# EAGLE design ac_mk2 (EAGLE 6.1)
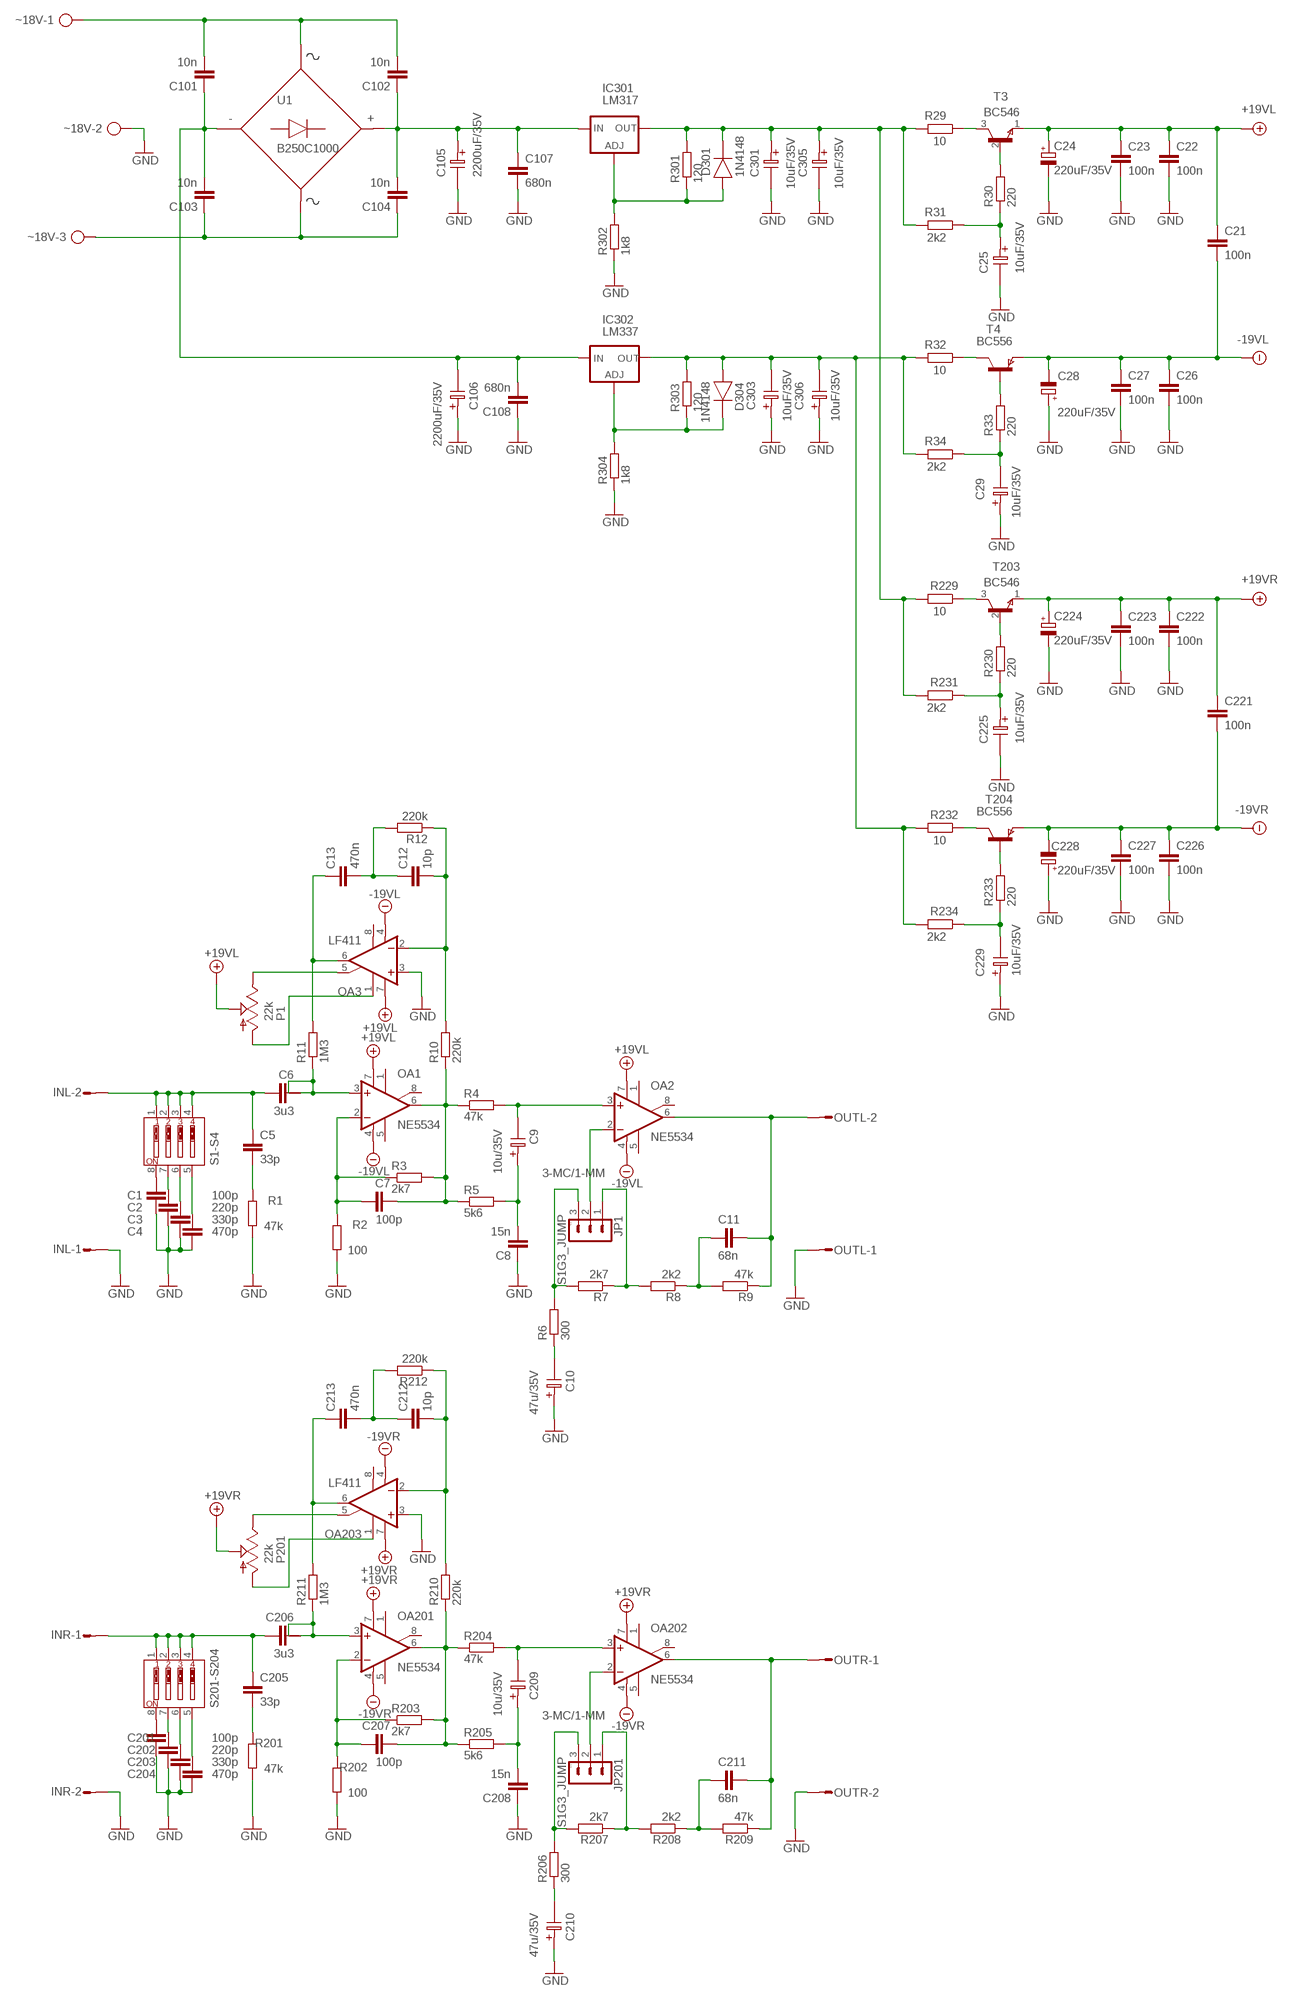
[diagram p0: schematic, sheet 1]

## Parts
C1  100p  C5/3.5  [C5B3.5]
C2  220p  C5/3.5  [C5B3.5]
C3  330p  C5/3.5  [C5B3.5]
C4  470p  C5/3.5  [C5B3.5]
C5  33p  KERAMICKYRM5  [KERAMICKY_RM5]
C6  3u3  C-10-15/6  [C10-15B6]
C7  100p  C5/3.5  [C5B3.5]
C8  15n  C5/3.5  [C5B3.5]
C9  10u/35V  CT07  [CT07]
C10  47u/35V  CT07  [CT07]
C11  68n  C5/3.5  [C5B3.5]
C12  10p  KERAMICKYRM5  [KERAMICKY_RM5]
C13  470n  C5/5.5  [C5B5.5]
C21  100n  C5/3.5  [C5B3.5]
C22  100n  C5/3.5  [C5B3.5]
C23  100n  C5/3.5  [C5B3.5]
C24  220uF/35V  ELEKTROLITICKYRM3,5-8  [ELEKTROLITICKY_RM3,5-8]
C25  10uF/35V  CT07  [CT07]
C26  100n  C5/3.5  [C5B3.5]
C27  100n  C5/3.5  [C5B3.5]
C28  220uF/35V  ELEKTROLITICKYRM3,5-8  [ELEKTROLITICKY_RM3,5-8]
C29  10uF/35V  CT07  [CT07]
C101  10n  C5/3.5  [C5B3.5]
C102  10n  C5/3.5  [C5B3.5]
C103  10n  C5/3.5  [C5B3.5]
C104  10n  C5/3.5  [C5B3.5]
C105  2200uF/35V  E16X25  [E160]
C106  2200uF/35V  E16X25  [E160]
C107  680n  C5/5.5  [C5B5.5]
C108  680n  C5/5.5  [C5B5.5]
C201  100p  C5/3.5  [C5B3.5]
C202  220p  C5/3.5  [C5B3.5]
C203  330p  C5/3.5  [C5B3.5]
C204  470p  C5/3.5  [C5B3.5]
C205  33p  KERAMICKYRM5  [KERAMICKY_RM5]
C206  3u3  C-10-15/6  [C10-15B6]
C207  100p  C5/3.5  [C5B3.5]
C208  15n  C5/3.5  [C5B3.5]
C209  10u/35V  CT07  [CT07]
C210  47u/35V  CT07  [CT07]
C211  68n  C5/3.5  [C5B3.5]
C212  10p  KERAMICKYRM5  [KERAMICKY_RM5]
C213  470n  C5/5.5  [C5B5.5]
C221  100n  C5/3.5  [C5B3.5]
C222  100n  C5/3.5  [C5B3.5]
C223  100n  C5/3.5  [C5B3.5]
C224  220uF/35V  ELEKTROLITICKYRM3,5-8  [ELEKTROLITICKY_RM3,5-8]
C225  10uF/35V  CT07  [CT07]
C226  100n  C5/3.5  [C5B3.5]
C227  100n  C5/3.5  [C5B3.5]
C228  220uF/35V  ELEKTROLITICKYRM3,5-8  [ELEKTROLITICKY_RM3,5-8]
C229  10uF/35V  CT07  [CT07]
C301  10uF/35V  CT07  [CT07]
C303  10uF/35V  CT07  [CT07]
C305  10uF/35V  CT07  [CT07]
C306  10uF/35V  CT07  [CT07]
D301  1N4148  [DO41]
D304  1N4148  [DO41]
IC301  LM317  LM317TS  [317TS]
IC302  LM337  LM337TS  [337TS]
INL  S02P  [S02P]
INR  S02P  [S02P]
JP1  S1G3_JUMP  [S1G3_JUM]
JP201  S1G3_JUMP  [S1G3_JUM]
OA1  NE5534  NE5534N  [DIL08]
OA2  NE5534  NE5534N  [DIL08]
OA3  LF411  LF411N  [DIL08]
OA201  NE5534  NE5534N  [DIL08]
OA202  NE5534  NE5534N  [DIL08]
OA203  LF411  LF411N  [DIL08]
OUTL  S02P  [S02P]
OUTR  S02P  [S02P]
P1  22k  TRIM_US-S64W  [S64W]
P201  22k  TRIM_US-S64W  [S64W]
R1  47k  R-EU_0207/10  [0207/10]
R2  100  R-EU_0207/10  [0207/10]
R3  2k7  R-EU_0207/10  [0207/10]
R4  47k  R-EU_0207/10  [0207/10]
R5  5k6  R-EU_0207/10  [0207/10]
R6  300  R-EU_0207/10  [0207/10]
R7  2k7  R-EU_0207/10  [0207/10]
R8  2k2  R-EU_0207/10  [0207/10]
R9  47k  R-EU_0207/10  [0207/10]
R10  220k  R-EU_0207/10  [0207/10]
R11  1M3  R-EU_0207/10  [0207/10]
R12  220k  R-EU_0207/10  [0207/10]
R29  10  R-EU_0207/10  [0207/10]
R30  220  R-EU_0207/10  [0207/10]
R31  2k2  R-EU_0207/10  [0207/10]
R32  10  R-EU_0207/10  [0207/10]
R33  220  R-EU_0207/10  [0207/10]
R34  2k2  R-EU_0207/10  [0207/10]
R201  47k  R-EU_0207/10  [0207/10]
R202  100  R-EU_0207/10  [0207/10]
R203  2k7  R-EU_0207/10  [0207/10]
R204  47k  R-EU_0207/10  [0207/10]
R205  5k6  R-EU_0207/10  [0207/10]
R206  300  R-EU_0207/10  [0207/10]
R207  2k7  R-EU_0207/10  [0207/10]
R208  2k2  R-EU_0207/10  [0207/10]
R209  47k  R-EU_0207/10  [0207/10]
R210  220k  R-EU_0207/10  [0207/10]
R211  1M3  R-EU_0207/10  [0207/10]
R212  220k  R-EU_0207/10  [0207/10]
R229  10  R-EU_0207/10  [0207/10]
R230  220  R-EU_0207/10  [0207/10]
R231  2k2  R-EU_0207/10  [0207/10]
R232  10  R-EU_0207/10  [0207/10]
R233  220  R-EU_0207/10  [0207/10]
R234  2k2  R-EU_0207/10  [0207/10]
R301  120  R-EU_0207/10  [0207/10]
R302  1k8  R-EU_0207/10  [0207/10]
R303  120  R-EU_0207/10  [0207/10]
R304  1k8  R-EU_0207/10  [0207/10]
S1-S4  DIP4X  [EDG-04]
S201-S204  DIP4X  [EDG-04]
T3  BC546  BC546A  [TO-92C]
T4  BC556  BC556B  [TO-92C]
T203  BC546  BC546A  [TO-92C]
T204  BC556  BC556B  [TO-92C]
U1  B250C1000  B250C1500  [DB1]
~18V  AK500/3  [AK500/3]

## Nets
+19VL: C21.1 C22.1 C23.1 C24.P$2(+) OA1.7(V+) OA2.7(V+) OA3.7(V+) P1.S T3.1(E)
+19VR: C221.1 C222.1 C223.1 C224.P$2(+) OA201.7(V+) OA202.7(V+) OA203.7(V+) P201.S T203.1(E)
-19VL: C21.2 C26.1 C27.1 C28.P$1(-) OA1.4(V-) OA2.4(V-) OA3.4(V-) T4.1(E)
-19VR: C221.2 C226.1 C227.1 C228.P$1(-) OA201.4(V-) OA202.4(V-) OA203.4(V-) T204.1(E)
GND: C1.2 C2.2 C3.2 C4.2 C8.1 C10.1 C22.2 C23.2 C24.P$1(-) C25.2 C26.2 C27.2 C28.P$2(+) C29.1 C105.2 C106.1 C107.2 C108.1 C201.2 C202.2 C203.2 C204.2 C208.1 C210.1 C222.2 C223.2 C224.P$1(-) C225.2 C226.2 C227.2 C228.P$2(+) C229.1 C301.2 C303.1 C305.2 C306.1 INL.1 INR.2 OA3.3(+IN) OA203.3(+IN) OUTL.1 OUTR.2 R1.1 R2.1 R201.1 R202.1 R302.1 R304.1 ~18V.2
N$1: JP1.2 OA2.2(-IN)
N$2: C10.2 R6.1
N$3: C101.1 C103.2 C106.2 C108.2 IC302.2(IN) U1.2
N$4: C102.1 C104.2 C105.1 C107.1 IC301.3(IN) U1.1
N$5: C5.P$2 R1.2
N$6: C6.2 C6.3 OA1.3(+IN) R11.1
N$7: C7.1 OA1.2(-IN) R2.2 R3.1
N$8: C7.2 OA1.6(OUT) R3.2 R4.1 R5.1 R10.1
N$9: C8.2 C9.1 R5.2
N$10: C11.1 OA2.6(OUT) OUTL.2 R9.1
N$11: JP1.3 R6.2 R7.2
N$12: C5.P$1 C6.1 INL.2 S1-S4.1 S1-S4.2 S1-S4.3 S1-S4.4
N$13: C1.1 S1-S4.8
N$14: C12.P$2 OA3.2(-IN) R10.2 R12.1
N$15: JP1.1 R7.1 R8.2
N$16: C11.2 R8.1 R9.2
N$17: C13.1 OA3.6(OUT) R11.2
N$18: C12.P$1 C13.2 R12.2
N$19: OA3.5(ON2) P1.E
N$20: OA3.1(ON1) P1.A
N$21: C205.P$1 C206.1 INR.1 S201-S204.1 S201-S204.2 S201-S204.3 S201-S204.4
N$22: C201.1 S201-S204.8
N$23: C2.1 S1-S4.7
N$24: C3.1 S1-S4.6
N$25: C4.1 S1-S4.5
N$26: C202.1 S201-S204.7
N$27: C203.1 S201-S204.6
N$28: C204.1 S201-S204.5
N$29: C205.P$2 R201.2
N$30: D301.A IC301.1(ADJ) R301.1 R302.2
N$31: C206.2 C206.3 OA201.3(+IN) R211.1
N$32: C207.1 OA201.2(-IN) R202.2 R203.1
N$33: C207.2 OA201.6(OUT) R203.2 R204.1 R205.1 R210.1
N$34: C208.2 C209.1 R205.2
N$35: C211.1 OA202.6(OUT) OUTR.1 R209.1
N$36: JP201.2 OA202.2(-IN)
N$37: C210.2 R206.1
N$38: JP201.3 R206.2 R207.2
N$39: JP201.1 R207.1 R208.2
N$40: C211.2 R208.1 R209.2
N$41: C212.P$2 OA203.2(-IN) R210.2 R212.1
N$42: C213.1 OA203.6(OUT) R211.2
N$43: C212.P$1 C213.2 R212.2
N$44: OA203.5(ON2) P201.E
N$45: OA203.1(ON1) P201.A
N$50: D304.K IC302.1(ADJ) R303.1 R304.2
N$51: C301.1 C305.1 D301.K IC301.2(OUT) R29.2 R31.2 R229.2 R231.2 R301.2
N$52: C303.2 C306.2 D304.A IC302.3(OUT) R32.2 R34.2 R232.2 R234.2 R303.2
N$53: R30.2 T3.2(B)
N$54: R29.1 T3.3(C)
N$55: C25.1 R30.1 R31.1
N$56: R33.2 T4.2(B)
N$57: R32.1 T4.3(C)
N$58: C29.2 R33.1 R34.1
N$59: R230.2 T203.2(B)
N$60: R229.1 T203.3(C)
N$61: C225.1 R230.1 R231.1
N$62: R233.2 T204.2(B)
N$63: R232.1 T204.3(C)
N$64: C229.2 R233.1 R234.1
N$65: C101.2 C102.2 U1.3 ~18V.1
N$66: C103.1 C104.1 U1.4 ~18V.3
OA1: C209.2 OA202.3(+IN) R204.2
OA2: C9.2 OA2.3(+IN) R4.2
Unconnected: OA1.1(ON) OA1.5(CMP) OA1.8(ON/CMP) OA2.1(ON) OA2.5(CMP) OA2.8(ON/CMP) OA3.8(OPT) OA201.1(ON) OA201.5(CMP) OA201.8(ON/CMP) OA202.1(ON) OA202.5(CMP) OA202.8(ON/CMP) OA203.8(OPT)

## Notes on the sheet
- 3-MC/1-MM
- 3-MC/1-MM

## Library data of the parts
C1-C4 C7 C8 C11 C13 C21-C23 C26 C27 C101-C104 C107 C108 C201-C204 C207 C208 C211 C213 C221-C223 C226 C227 = capacitor-wima:C: CAPACITOR naming: grid - package width
C5 C12 C205 C212 = #Kondenzatory:KERAMICKY
C6 C206 = capacitor-wima:C-: CAPACITOR for alternative placement naming: default grid - extended grid/package width
C9 C10 C25 C29 C209 C210 C225 C229 C301 C303 C305 C306 = #_GM99:CT07
C24 C28 C224 C228 = #Kondenzatory:ELEKTROLITICKY
C105 C106 = #_GM99:E16X25
D301 D304 = #_GM99:1N4148
IC301 = v-reg:LM317TS: VOLTAGE REGULATOR
IC302 = v-reg:LM337TS: VOLTAGE REGULATOR
INL INR OUTL OUTR = con-amp-mt:S02P: AMP MT CONNECTOR; OC_FARNELL: unknown; OC_NEWARK: unknown
JP1 JP201 = #PaJa_22:S1G3_JUMP: Radove konektory - koliky - 3x
OA1 OA2 OA201 OA202 = linear:NE5534: LOW-NOISE OPERATIONAL AMPLIFIER Source: http://focus.ti.com/lit/ds/symlink/ne5534.pdf
OA3 OA203 = linear:LF411: OP AMP
P1 P201 = pot:TRIM_US-: POTENTIOMETER
R1-R12 R29-R34 R201-R212 R229-R234 R301-R304 = #Odpory:R-EU_: RESISTOR, European symbol
S1-S4 S201-S204 = #_GM99:DIP4X
T3 T203 = #_GM99:BC546A
T4 T204 = #_GM99:BC556B
U1 = #_GM99:B250C1500
~18V = #Svorkovnice:AK500/3: CONNECTOR

## Board
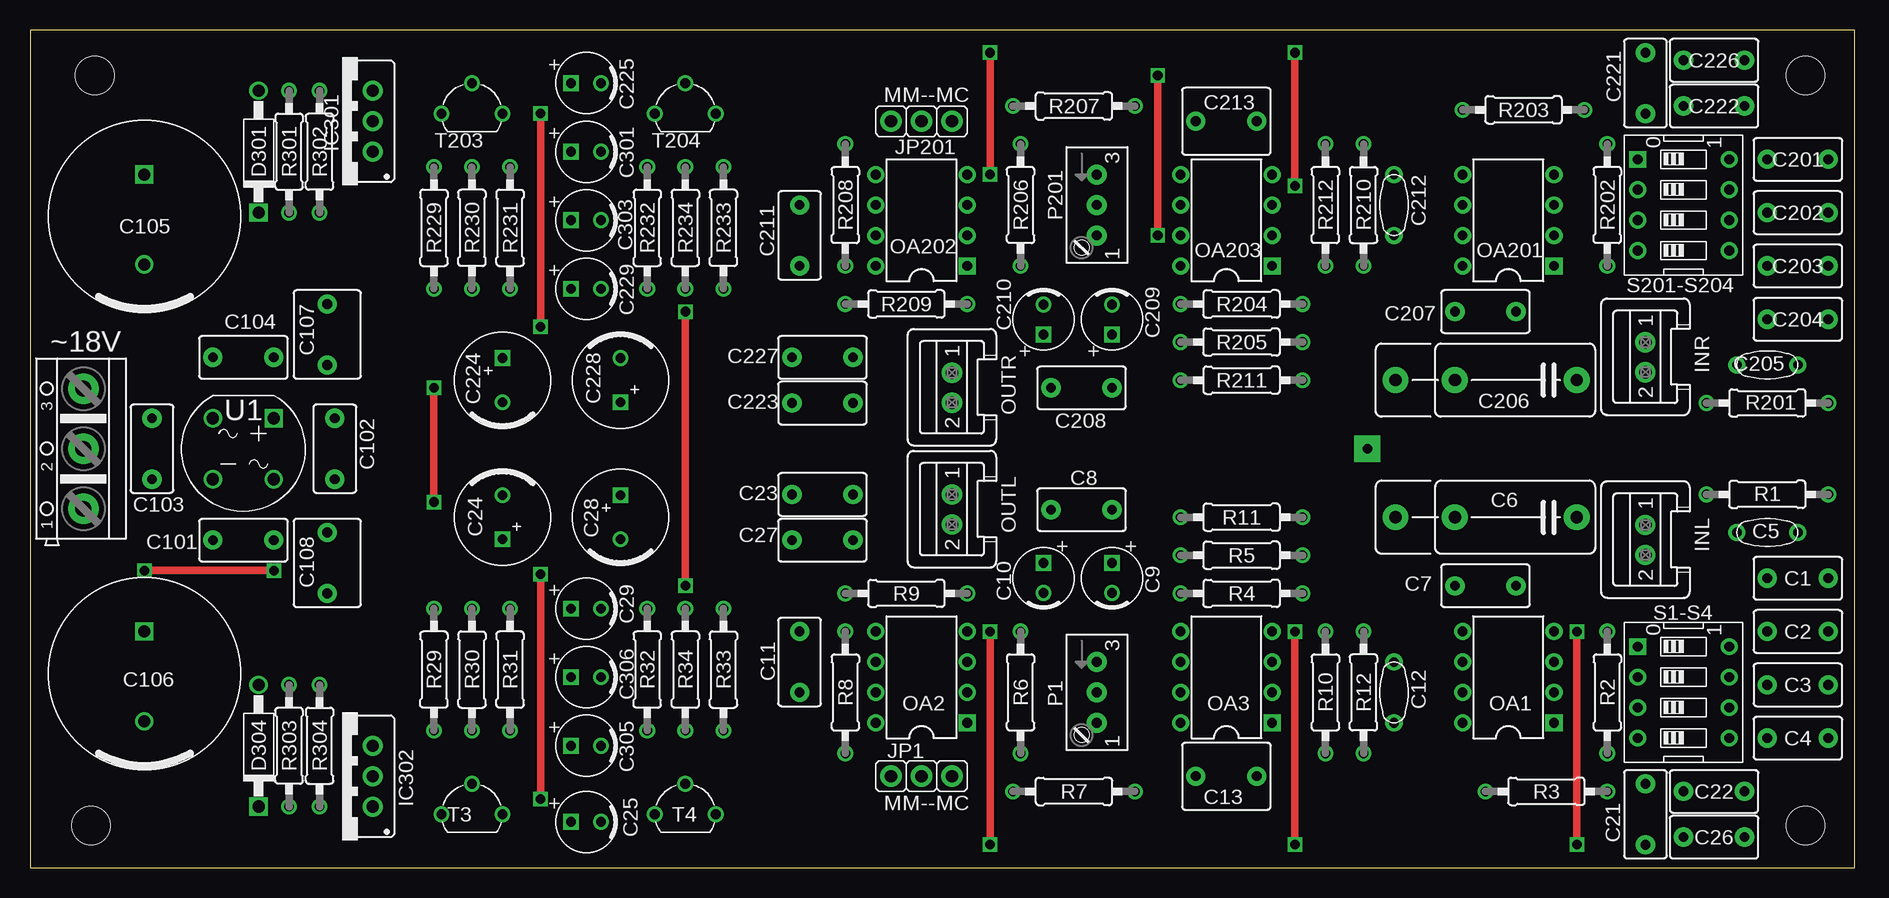
[diagram p1: board, top side]
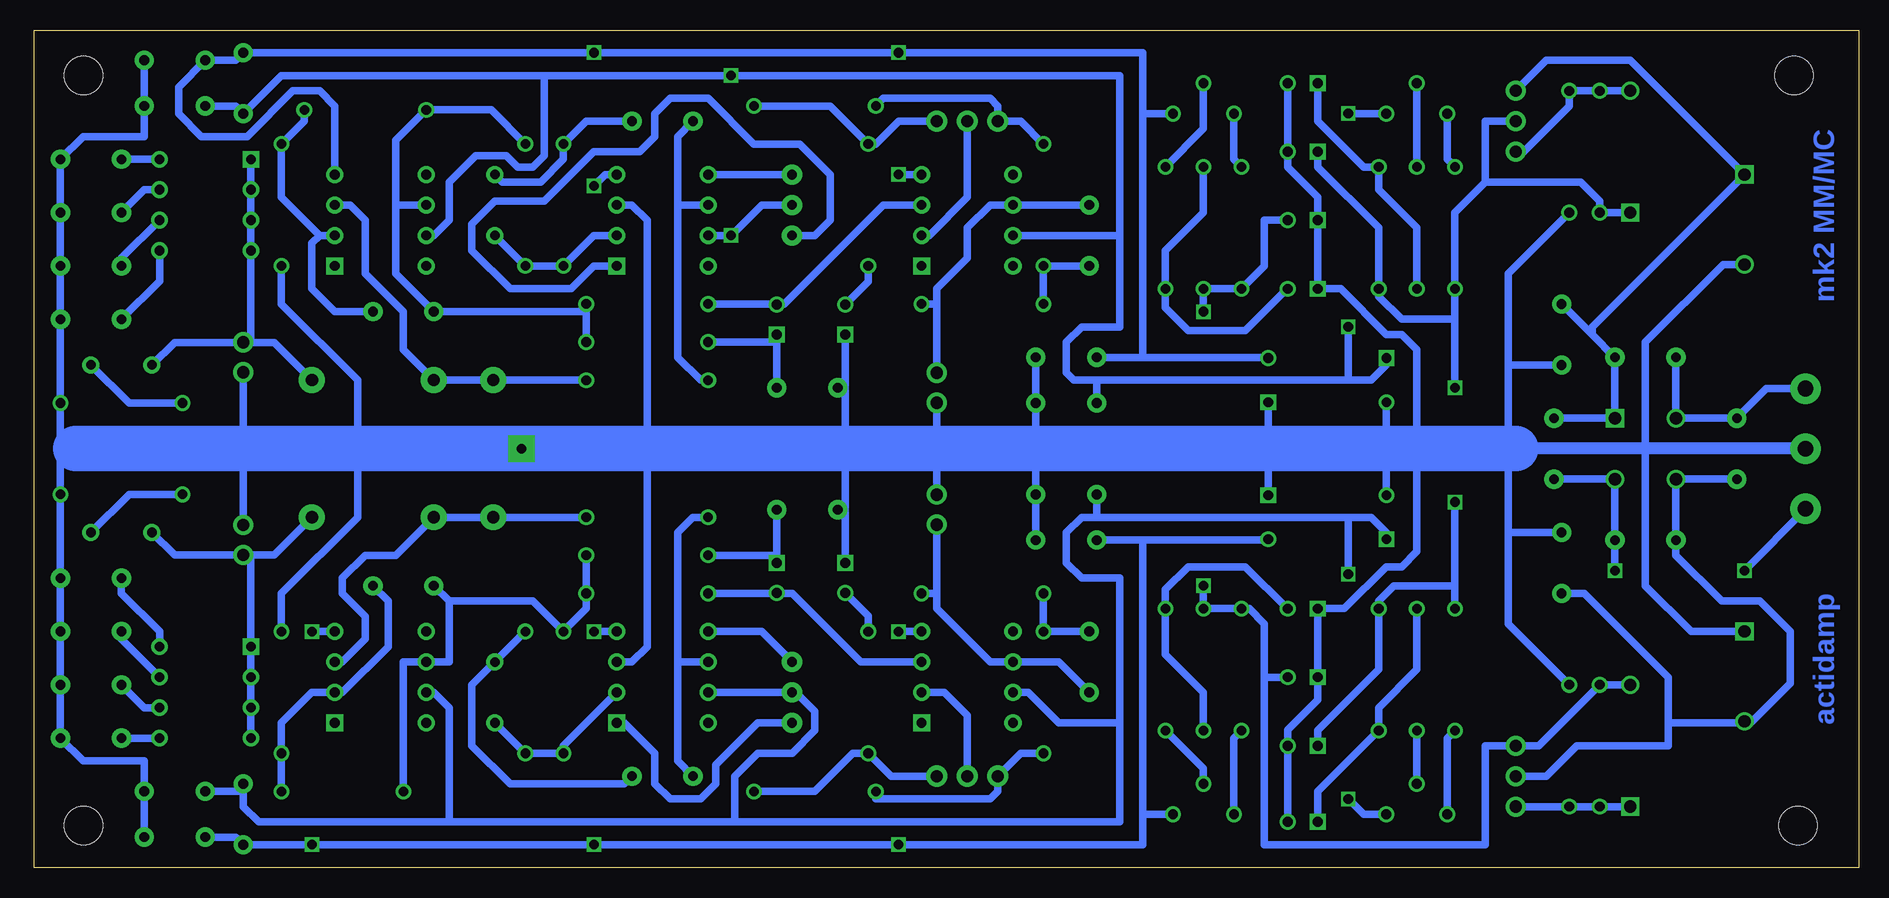
[diagram p2: board, bottom side, seen from below]

Size 152.06 x 69.84 mm. Coordinates in mm from the lower left corner, seen from the top.
Outline: 0,0 152.06,0 152.06,69.84 0,69.84 0,0
Copper layers (1*16): Top 0.035mm / dielectric 1.5mm / Bottom 0.035mm
Design rules: minimum track width 10mil, minimum drill 24mil, track to track 8mil, track to pad 8mil, pad to pad 8mil, via to via 8mil, smd to smd 8mil, copper to edge 40mil, drill to drill 8mil, minimum pad ring 10mil, minimum via ring 8mil, stop-mask expansion 4mil, vias tented up to drill 0mil, thermal gap 10mil
Holes 3.2 mm at 5.4,66.04 5.08,3.49 147.96,3.49 147.96,66.04

### Footprints (pad centres in the part's own frame; a part is rotated, then mirrored left to right if it is on the bottom)
C5B3.5 = drill 0.813 pad 1.6: 1 -2.54,0; 2 2.54,0
KERAMICKY_RM5 = drill 0.8 pad 1.422: P$1 -2.54,0; P$2 2.54,0
C10-15B6 = drill 1.016 pad 2.159: 1 -5.08,0; 2 5.08,0; 3 10.033,0
CT07 = drill 0.813 square: 1 0,0 | drill 0.813: 2 2.5,0
C5B5.5 = drill 0.813 pad 1.6: 1 -2.54,0; 2 2.54,0
ELEKTROLITICKY_RM3,5-8 = drill 0.8: P$1 -1.84,0 | drill 0.8 square: P$2 1.84,0
E160 = drill 1.016 square: 1 0,0 | drill 1.016: 2 7.5,0
DO41 = drill 1.016: A 5.08,0 | drill 1.016 square: K -5.08,0
317TS = drill 1.016 pad 1.676: 1 -2.54,-2.54; 2 0,-2.54; 3 2.54,-2.54
337TS = drill 1.016 pad 1.676: 1 -2.54,-2.54; 2 0,-2.54; 3 2.54,-2.54
S02P = drill 1.016 pad 1.676: 1 1.25,0; 2 -1.25,0
S1G3_JUM = drill 1.016 pad 1.778: 1 -2.54,0; 2 0,0; 3 2.54,0
DIL08 = drill 0.813 pad 1.422 square: 1 -3.81,-3.81 | drill 0.813 pad 1.422: 2 -1.27,-3.81; 3 1.27,-3.81; 4 3.81,-3.81; 5 3.81,3.81; 6 1.27,3.81; 7 -1.27,3.81; 8 -3.81,3.81
S64W = drill 0.813 pad 1.676: A 2.54,1.27; E -2.54,1.27; S 0,1.27
0207/10 = drill 0.8: 1 -5.08,0; 2 5.08,0
EDG-04 = drill 0.813 pad 1.397 square: 1 0,0 | drill 0.813 pad 1.397: 2 2.54,0; 3 5.08,0; 4 7.62,0; 5 7.62,7.62; 6 5.08,7.62; 7 2.54,7.62; 8 0,7.62
TO-92C = drill 0.813: 1 0,-2.54; 2 2.54,0; 3 0,2.54
DB1 = drill 1.016 square: 1 0,0 | drill 1.016: 2 5.08,5.08; 3 0,5.08; 4 5.08,0
AK500/3 = drill 1.321 pad 2.54: 1 -5.004,0; 2 0,0; 3 5.004,0

### Placement (x,y rotation side)
C1  147.32,24.13 0 top
C2  147.32,19.68 0 top
C3  147.32,15.24 0 top
C4  147.32,10.79 0 top
C5  144.78,27.94 0 top
C6  123.83,29.21 180 top
C7  121.28,23.5 180 top
C8  87.63,29.84 0 top
C9  90.17,25.4 270 top
C10  84.45,25.4 270 top
C11  64.14,17.14 90 top
C12  113.67,14.61 270 top
C13  99.69,7.62 0 top
C21  134.62,4.45 270 top
C22  140.34,6.35 0 top
C23  66.04,31.11 0 top
C24  39.37,29.21 270 top
C25  45.09,3.81 0 top
C26  140.34,2.54 0 top
C27  66.04,27.3 0 top
C28  49.21,29.21 90 top
C29  45.09,21.59 0 top
C101  17.78,27.3 0 top
C102  25.4,34.92 270 top
C103  10.16,34.92 270 top
C104  17.78,42.55 0 top
C105  9.53,57.78 270 top
C106  9.53,19.68 270 top
C107  24.77,44.45 270 top
C108  24.77,25.4 270 top
C201  147.32,59.05 0 top
C202  147.32,54.61 0 top
C203  147.32,50.16 0 top
C204  147.32,45.72 0 top
C205  144.78,41.91 0 top
C206  123.83,40.64 180 top
C207  121.28,46.35 180 top
C208  87.63,40.01 0 top
C209  90.17,44.45 90 top
C210  84.45,44.45 90 top
C211  64.14,52.7 270 top
C212  113.67,55.24 270 top
C213  99.69,62.23 0 top
C221  134.62,65.41 90 top
C222  140.34,63.5 0 top
C223  66.04,38.73 0 top
C224  39.37,40.64 90 top
C225  45.09,65.41 0 top
C226  140.34,67.31 0 top
C227  66.04,42.55 0 top
C228  49.21,40.64 270 top
C229  45.09,48.26 0 top
C301  45.09,59.69 0 top
C303  45.09,53.98 0 top
C305  45.09,10.16 0 top
C306  45.09,15.88 0 top
D301  19.05,59.69 90 top
D304  19.05,10.16 90 top
IC301  26.04,62.23 90 top
IC302  26.04,7.62 90 top
INL  134.62,27.3 90 top
INR  134.62,42.55 90 top
JP1  74.3,7.62 0 top
JP201  74.3,62.23 0 top
OA1  123.19,15.88 90 top
OA2  74.3,15.88 90 top
OA3  99.69,15.88 90 top
OA201  123.19,53.98 90 top
OA202  74.3,53.98 90 top
OA203  99.69,53.98 90 top
OUTL  76.83,29.84 90 top
OUTR  76.83,40.01 90 top
P1  87.63,14.61 270 top
P201  87.63,55.24 270 top
R1  144.78,31.11 180 top
R2  131.44,14.61 270 top
R3  126.36,6.35 180 top
R4  100.97,22.86 180 top
R5  100.97,26.04 180 top
R6  82.55,14.61 270 top
R7  87,6.35 0 top
R8  67.94,14.61 270 top
R9  73.03,22.86 180 top
R10  107.95,14.61 270 top
R11  100.97,29.21 180 top
R12  111.12,14.61 90 top
R29  33.66,16.51 90 top
R30  36.83,16.51 270 top
R31  40.01,16.51 90 top
R32  51.44,16.51 90 top
R33  57.78,16.51 270 top
R34  54.61,16.51 90 top
R201  144.78,38.73 180 top
R202  131.44,55.24 90 top
R203  124.46,63.18 180 top
R204  100.97,46.99 180 top
R205  100.97,43.81 180 top
R206  82.55,55.24 90 top
R207  87,63.5 0 top
R208  67.94,55.24 90 top
R209  73.03,46.99 180 top
R210  111.12,55.24 270 top
R211  100.97,40.64 180 top
R212  107.95,55.24 90 top
R229  33.66,53.34 270 top
R230  36.83,53.34 90 top
R231  40.01,53.34 270 top
R232  51.44,53.34 270 top
R233  57.78,53.34 90 top
R234  54.61,53.34 270 top
R301  21.59,59.69 270 top
R302  24.13,59.69 90 top
R303  21.59,10.16 90 top
R304  24.13,10.16 270 top
S1-S4  133.99,18.41 270 top
S201-S204  133.99,59.05 270 top
T3  36.83,4.45 90 top
T4  54.61,4.45 90 top
T203  36.83,62.87 90 top
T204  54.61,62.87 90 top
U1  20.32,37.47 180 top
~18V  4.45,34.92 90 top

### Tracks (layer width: path | path; a pad name or v marks a point on that pad's centre or on a via)
+19VL  (via drill 0.8)
  Top 0.61: v42.55,5.71 v42.55,24.45
  Bottom 0.61: C24.P$2 39.37,27.94 40.64,29.21 42.55,29.21 | 63.5,29.21 64.77,29.21 66.04,27.94 66.04,25.4 64.77,24.13 61.59,24.13 61.59,12.06 | 42.55,29.21 63.5,29.21 | 134.62,6.35 134.62,5.08 133.35,3.81 117.47,3.81 | 134.62,6.35 C21.1 | 93.66,3.81 61.59,3.81 61.59,12.06 | 93.66,3.81 117.47,3.81 | 63.5,29.21 C23.1 | OA2.7 69.22,14.61 66.67,12.06 61.59,12.06 | OA3.7 P1.S 88.58,14.61 87,13.02 87,11.43 88.9,9.53 91.76,9.53 93.66,7.62 93.66,3.81 | OA1.7 118.75,14.61 117.47,13.34 117.47,3.81 | 134.62,6.35 C22.1 | T3.1 41.27,4.45 v42.55,5.71 | v42.55,24.45 42.55,29.21
+19VR  (via drill 0.8)
  Top 0.61: v42.55,45.09 v42.55,62.87 | v93.98,66.04 v93.98,52.7
  Bottom 0.61: 63.5,40.64 C223.1 | 63.5,40.64 65.41,40.64 66.04,41.27 66.04,43.81 64.77,45.09 61.59,45.09 61.59,52.7 | 61.59,52.7 61.59,66.04 v93.98,66.04 109.54,66.04 | C222.1 135.25,63.5 C221.1 131.44,66.04 109.54,66.04 | v42.55,62.87 T203.1 | 61.59,52.7 OA202.7 | OA203.7 v93.98,52.7 91.44,55.24 P201.S | C224.P$2 39.37,41.91 40.64,40.64 42.55,40.64 | 42.55,40.64 63.5,40.64 | 42.55,40.64 v42.55,45.09 | OA201.7 118.75,52.7 117.47,53.98 117.47,57.15 115.25,59.37 112.71,59.37 111.76,58.42 110.49,58.42 109.54,59.37 109.54,66.04
-19VL  (via drill 0.8)
  Top 0.61: v80.01,1.91 v80.01,19.68 | v105.41,1.91 v105.41,19.68 | v128.91,1.91 v128.91,19.68
  Bottom 0.61: 59.69,4.45 59.69,1.91 v80.01,1.91 v105.41,1.91 v128.91,1.91 C21.2 135.25,2.54 C26.1 | 59.69,4.45 59.69,27.3 | 59.69,27.3 C27.1 | v80.01,19.68 OA2.4 | v105.41,19.68 OA3.4 | v128.91,19.68 OA1.4 | T4.1 59.69,4.45 | 59.69,27.3 49.28,27.3 C28.P$1
-19VR  (via drill 0.8)
  Top 0.61: v80.01,67.94 v80.01,57.78 | v105.41,67.94 v105.41,56.83
  Bottom 0.61: 59.69,42.55 59.69,62.87 | 59.69,62.87 59.69,67.94 v80.01,67.94 v105.41,67.94 C221.2 135.25,67.31 C226.1 140.02,65.09 140.02,62.87 138.11,60.96 134.3,60.96 130.49,64.77 128.27,64.77 127,63.5 OA201.4 | 59.69,42.55 C227.1 | 59.69,62.87 T204.1 | v80.01,57.78 OA202.4 | OA203.4 104.46,57.78 v105.41,56.83 | 59.69,42.55 49.28,42.55 C228.P$1
GND  (via drill 0.8 pad 2.18)
  Bottom 0.61: OUTR.2 76.83,34.92 OUTL.1 | 84.45,29.84 84.45,34.92 84.45,40.01 | 84.45,29.84 C10.1 | 84.45,29.84 C8.1 | OA3.3 102.23,17.14 100.97,18.41 100.97,34.92 100.97,53.98 102.23,55.24 OA203.3 | 148.59,34.92 149.86,34.92 | INL.1 134.62,34.92 INR.2 | 149.86,34.92 R1.1 C1.2 C2.2 C3.2 C4.2 147.96,8.89 142.88,8.89 C22.2 C26.2 | 84.45,40.01 C210.1 | 84.45,40.01 C208.1 | 149.86,34.92 R201.1 C204.2 C203.2 C202.2 C201.2 147.96,60.96 142.88,60.96 C222.2 C226.2 | R202.1 131.44,46.99 125.09,40.64 125.09,34.92 125.09,29.21 131.44,22.86 R2.1 | C227.2 C223.2 68.58,34.92 C23.2 C27.2 | C225.2 C301.2 47.59,58.38 45.09,55.88 C303.1 C229.1 43.18,48.26 39.37,44.45 38.1,44.45 36.83,43.18 36.83,34.92 36.83,26.35 38.1,25.08 39.37,25.08 42.86,21.59 C29.1 C306.1 45.09,13.97 47.59,11.47 C305.2 C25.2 | C105.2 11.31,50.28 17.78,43.81 17.78,34.92 17.78,23.5 13.97,19.68 C106.1 | C228.P$2 49.21,34.92 C28.P$2 | 39.37,34.92 C224.P$1 | C24.P$1 39.37,34.29 38.73,34.92 | R304.1 29.21,20.32 29.21,27.94 | 29.21,27.94 29.21,34.92 29.21,41.91 | C108.1 29.21,27.94 | R302.1 29.21,49.53 29.21,41.91 | C107.2 29.21,41.91
  Bottom 1.016: 28.57,34.92 17.78,34.92 ~18V.2
  Bottom 3.81: 28.57,34.92 29.21,34.92 36.83,34.92 38.73,34.92 39.37,34.92 49.21,34.92 68.58,34.92 76.83,34.92 84.45,34.92 100.97,34.92 v111.44,34.92 125.09,34.92 134.62,34.92 148.59,34.92
N$1
  Bottom 0.61: OA2.2 76.2,14.61 74.3,12.7 JP1.2
N$2
  Bottom 0.61: R6.1 82.55,21 C10.2
N$3
  Bottom 0.61: C103.2 U1.2 C101.1 15.24,26.04 11.43,22.23 8.26,22.23 5.71,19.68 5.71,15.36 8.89,12.19 C106.2 9.64,12.06 15.88,12.06 | C108.2 22.86,22.86 15.88,15.88 15.88,12.06 | IC302.2 26.04,7.62 23.5,10.16 15.88,10.16 15.88,12.06
N$4
  Bottom 0.61: IC301.3 26.04,67.31 19.05,67.31 C105.1 22.23,45.09 22.23,44.45 | C102.1 U1.1 C104.2 22.23,44.45 | 22.23,44.45 C107.1
N$5
  Bottom 0.61: R1.2 144.15,31.11 C5.P$2
N$6
  Bottom 0.61: OA1.3 126.36,17.14 124.46,19.05 124.46,20.95 126.36,22.86 126.36,24.13 124.46,26.04 121.92,26.04 C6.2 C6.3 R11.1
N$7
  Bottom 0.61: R3.1 R2.2 131.44,12.06 128.91,14.61 OA1.2 126.36,14.61 122.56,18.41 122.56,22.23 C7.1
N$8
  Bottom 0.61: R5.1 R4.1 106.05,21.59 R10.1 110.49,22.23 117.47,22.23 | 117.47,22.23 117.47,17.14 OA1.6 121.28,17.14 R3.2 | 117.47,22.23 C7.2
N$9
  Bottom 0.61: C9.1 90.17,26.04 | 90.17,26.04 C8.2 | 90.17,26.04 R5.2
N$10
  Bottom 0.61: 76.83,22.86 76.83,21.59 72.39,17.14 OA2.6 66.67,17.14 C11.1 | 76.83,22.86 OUTL.2 | 76.83,22.86 R9.1
N$11
  Bottom 0.61: R7.2 87,6.35 83.82,9.53 R6.2 80.64,7.62 JP1.3
N$12
  Bottom 0.61: S1-S4.4 S1-S4.3 S1-S4.2 S1-S4.1 133.99,26.05 | 133.99,26.05 INL.2 140.35,26.05 C5.P$1 | 133.99,26.05 132.06,26.05 C6.1
N$13
  Bottom 0.61: S1-S4.8 141.6,19.68 144.78,22.86 C1.1
N$14
  Bottom 0.61: OA3.2 107.95,10.16 R10.2 R12.1 C12.P$2
N$15
  Bottom 0.61: R8.2 69.85,9.53 JP1.1 71.75,6.35 72.39,5.71 81.92,5.71 R7.1
N$16
  Bottom 0.61: R9.2 R8.1 C11.2
N$17
  Bottom 0.61: 98.42,17.14 OA3.6 | C13.1 98.42,8.89 98.42,17.14 | R11.2 97.16,29.21 98.42,27.94 98.42,17.14
N$18
  Bottom 0.61: R12.2 C12.P$1 115.57,15.24 115.57,10.16 112.39,6.99 102.87,6.99 C13.2
N$19
  Bottom 0.61: OA3.5 91.44,19.68 P1.E
N$20
  Bottom 0.61: OA3.1 102.87,12.06 100.33,9.53 100.33,6.99 99.06,5.71 96.52,5.71 95.25,6.99 95.25,8.57 91.76,12.06 P1.A
N$21
  Bottom 0.61: S201-S204.1 S201-S204.2 S201-S204.3 S201-S204.4 133.99,43.81 134.6,43.81 INR.1 | INR.1 132.06,43.8 C206.1 | INR.1 140.35,43.8 C205.P$1
N$22
  Bottom 0.61: S201-S204.8 C201.1
N$23
  Bottom 0.61: S1-S4.7 144.78,19.05 C2.1
N$24
  Bottom 0.61: S1-S4.6 142.88,13.34 C3.1
N$25
  Bottom 0.61: S1-S4.5 C4.1
N$26
  Bottom 0.61: S201-S204.7 142.88,56.52 C202.1
N$27
  Bottom 0.61: S201-S204.6 144.78,50.8 C203.1
N$28
  Bottom 0.61: S201-S204.5 141.6,48.9 C204.1
N$29
  Bottom 0.61: R201.2 144.15,38.73 C205.P$2
N$30
  Bottom 0.61: D301.A R301.1 R302.2 24.13,63.5 27.94,59.69 IC301.1
N$31
  Bottom 0.61: OA201.3 125.73,55.24 124.46,53.98 124.46,49.53 121.28,46.35 121.28,43.18 C206.2 C206.3 R211.1
N$32
  Bottom 0.61: R203.1 129.54,62.23 R202.2 131.44,55.88 128.27,52.7 | 128.27,52.7 OA201.2 | C207.1 127,46.35 128.91,48.26 128.91,52.07 128.27,52.7
N$33
  Bottom 0.61: R210.1 113.98,63.18 R203.2 121.92,60.64 121.92,55.24 | R205.1 106.05,46.35 | 106.05,46.35 R204.1 | 121.92,55.24 121.92,49.53 C207.2 106.05,46.35 | 121.92,55.24 OA201.6
N$34
  Bottom 0.61: 90.17,43.81 R205.2 | C208.2 90.17,43.81 | 90.17,43.81 C209.1
N$35
  Bottom 0.61: 76.83,46.99 76.83,48.26 74.3,50.8 74.3,53.34 72.39,55.24 OA202.6 C211.1 | OUTR.1 76.83,46.99 | 76.83,46.99 R209.1
N$36
  Bottom 0.61: OA202.2 77.47,52.7 74.3,55.88 JP201.2
N$37
  Bottom 0.61: R206.1 82.55,48.85 C210.2
N$38
  Bottom 0.61: R207.2 85.72,63.5 R206.2 81.92,60.33 80.01,62.23 JP201.3
N$39
  Bottom 0.61: R208.2 69.85,62.23 JP201.1 71.75,63.5 72.39,64.14 81.28,64.14 R207.1
N$40
  Bottom 0.61: R209.2 R208.1 C211.2
N$41
  Bottom 0.61: OA203.2 105.41,52.7 R212.1 R210.2 C212.P$2
N$42
  Bottom 0.61: R211.2 96.52,40.64 98.42,42.55 98.42,55.24 | 98.42,55.24 98.42,60.96 C213.1 | 98.42,55.24 OA203.6
N$43
  Bottom 0.61: C213.2 106.05,62.23 R212.2 107.95,59.05 109.86,57.15 113.03,57.15 C212.P$1
N$44
  Bottom 0.61: P201.E OA203.5
N$45
  Bottom 0.61: P201.A 87,52.7 85.72,53.98 85.72,57.78 88.27,60.33 92.08,60.33 95.89,64.14 99.06,64.14 100.33,62.87 100.33,60.96 101.6,59.69 105.41,59.69 109.54,55.56 113.67,55.56 115.57,53.66 115.57,51.44 112.39,48.26 107.31,48.26 105.41,50.16 OA203.1
N$50
  Bottom 0.61: D304.K R303.1 R304.2 IC302.1
N$51  (via drill 0.8)
  Top 0.61: v33.66,30.48 v33.66,40.01
  Bottom 0.61: IC301.2 31.11,62.23 31.11,57.15 | D301.K R301.2 21.59,55.56 23.18,57.15 31.11,57.15 | v33.66,40.01 33.66,45.72 | 33.66,45.72 R229.2 33.66,54.61 31.11,57.15 | C301.1 45.09,58.42 40.01,53.34 R231.2 40.01,47.62 38.1,45.72 33.66,45.72 | R29.2 33.66,23.5 | 33.66,23.5 v33.66,30.48 | 33.66,23.5 38.73,23.5 40.01,22.23 R31.2 40.01,16.51 45.09,11.43 C305.1
N$52  (via drill 0.8)
  Top 0.61: v54.61,46.35 v54.61,23.5
  Bottom 0.61: C303.2 49.53,53.98 49.53,50.16 R232.2 R234.2 v54.61,46.35 | 49.53,15.88 49.53,1.91 31.11,1.91 31.11,10.16 IC302.3 26.67,10.16 R303.2 D304.A | 49.53,15.88 49.53,20.32 50.8,21.59 R32.2 R34.2 v54.61,23.5 | 49.53,15.88 C306.2
N$53
  Bottom 0.61: T3.2 R30.2
N$54
  Bottom 0.61: T3.3 34.29,10.79 R29.1
N$55
  Bottom 0.61: C25.1 45.09,6.35 R31.1 40.01,13.34 36.83,16.51 R30.1
N$56
  Bottom 0.61: T4.2 54.61,8.26 R33.2
N$57
  Bottom 0.61: T4.3 52.07,10.79 R32.1
N$58
  Bottom 0.61: R34.1 54.61,14.61 57.78,17.78 R33.1 57.78,23.18 55.88,25.08 51.12,25.08 47.62,21.59 C29.2
N$59
  Bottom 0.61: R230.2 T203.2
N$60
  Bottom 0.61: T203.3 34.29,59.05 R229.1
N$61
  Bottom 0.61: C225.1 45.09,62.23 41.27,58.42 R231.1 40.01,56.52 36.83,53.34 R230.1
N$62
  Bottom 0.61: T204.2 54.61,61.59 R233.2
N$63
  Bottom 0.61: T204.3 52.07,59.05 R232.1
N$64
  Bottom 0.61: R234.1 54.61,54.61 57.78,51.44 R233.1 57.78,46.67 55.88,44.77 51.12,44.77 47.62,48.26 C229.2
N$65  (via drill 0.8)
  Top 0.61: v9.53,24.77 v20.32,24.77
  Bottom 0.61: C102.2 U1.3 C101.2 v20.32,24.77 | ~18V.1 4.45,29.84 v9.53,24.77
N$66
  Bottom 0.61: C104.1 U1.4 C103.1 7.7,39.93 ~18V.3
OA1
  Bottom 0.61: R204.2 90.21,46.99 C209.2 90.13,46.99 89.53,46.99 81.28,55.24 OA202.3
OA2
  Bottom 0.61: OA2.3 83.19,17.14 88.9,22.86 90.13,22.86 C9.2 90.17,22.86 R4.2

### Text on the board
Bottom: mk2 MM/MC | actidamp
tNames: MM--MC | MM--MC